# Altium schematic sheet CON_FMC_400PIN.SchDoc: FMC Connector
size A3; DocumentNumber: 12; SheetNumber: 12; SheetTotal: 12
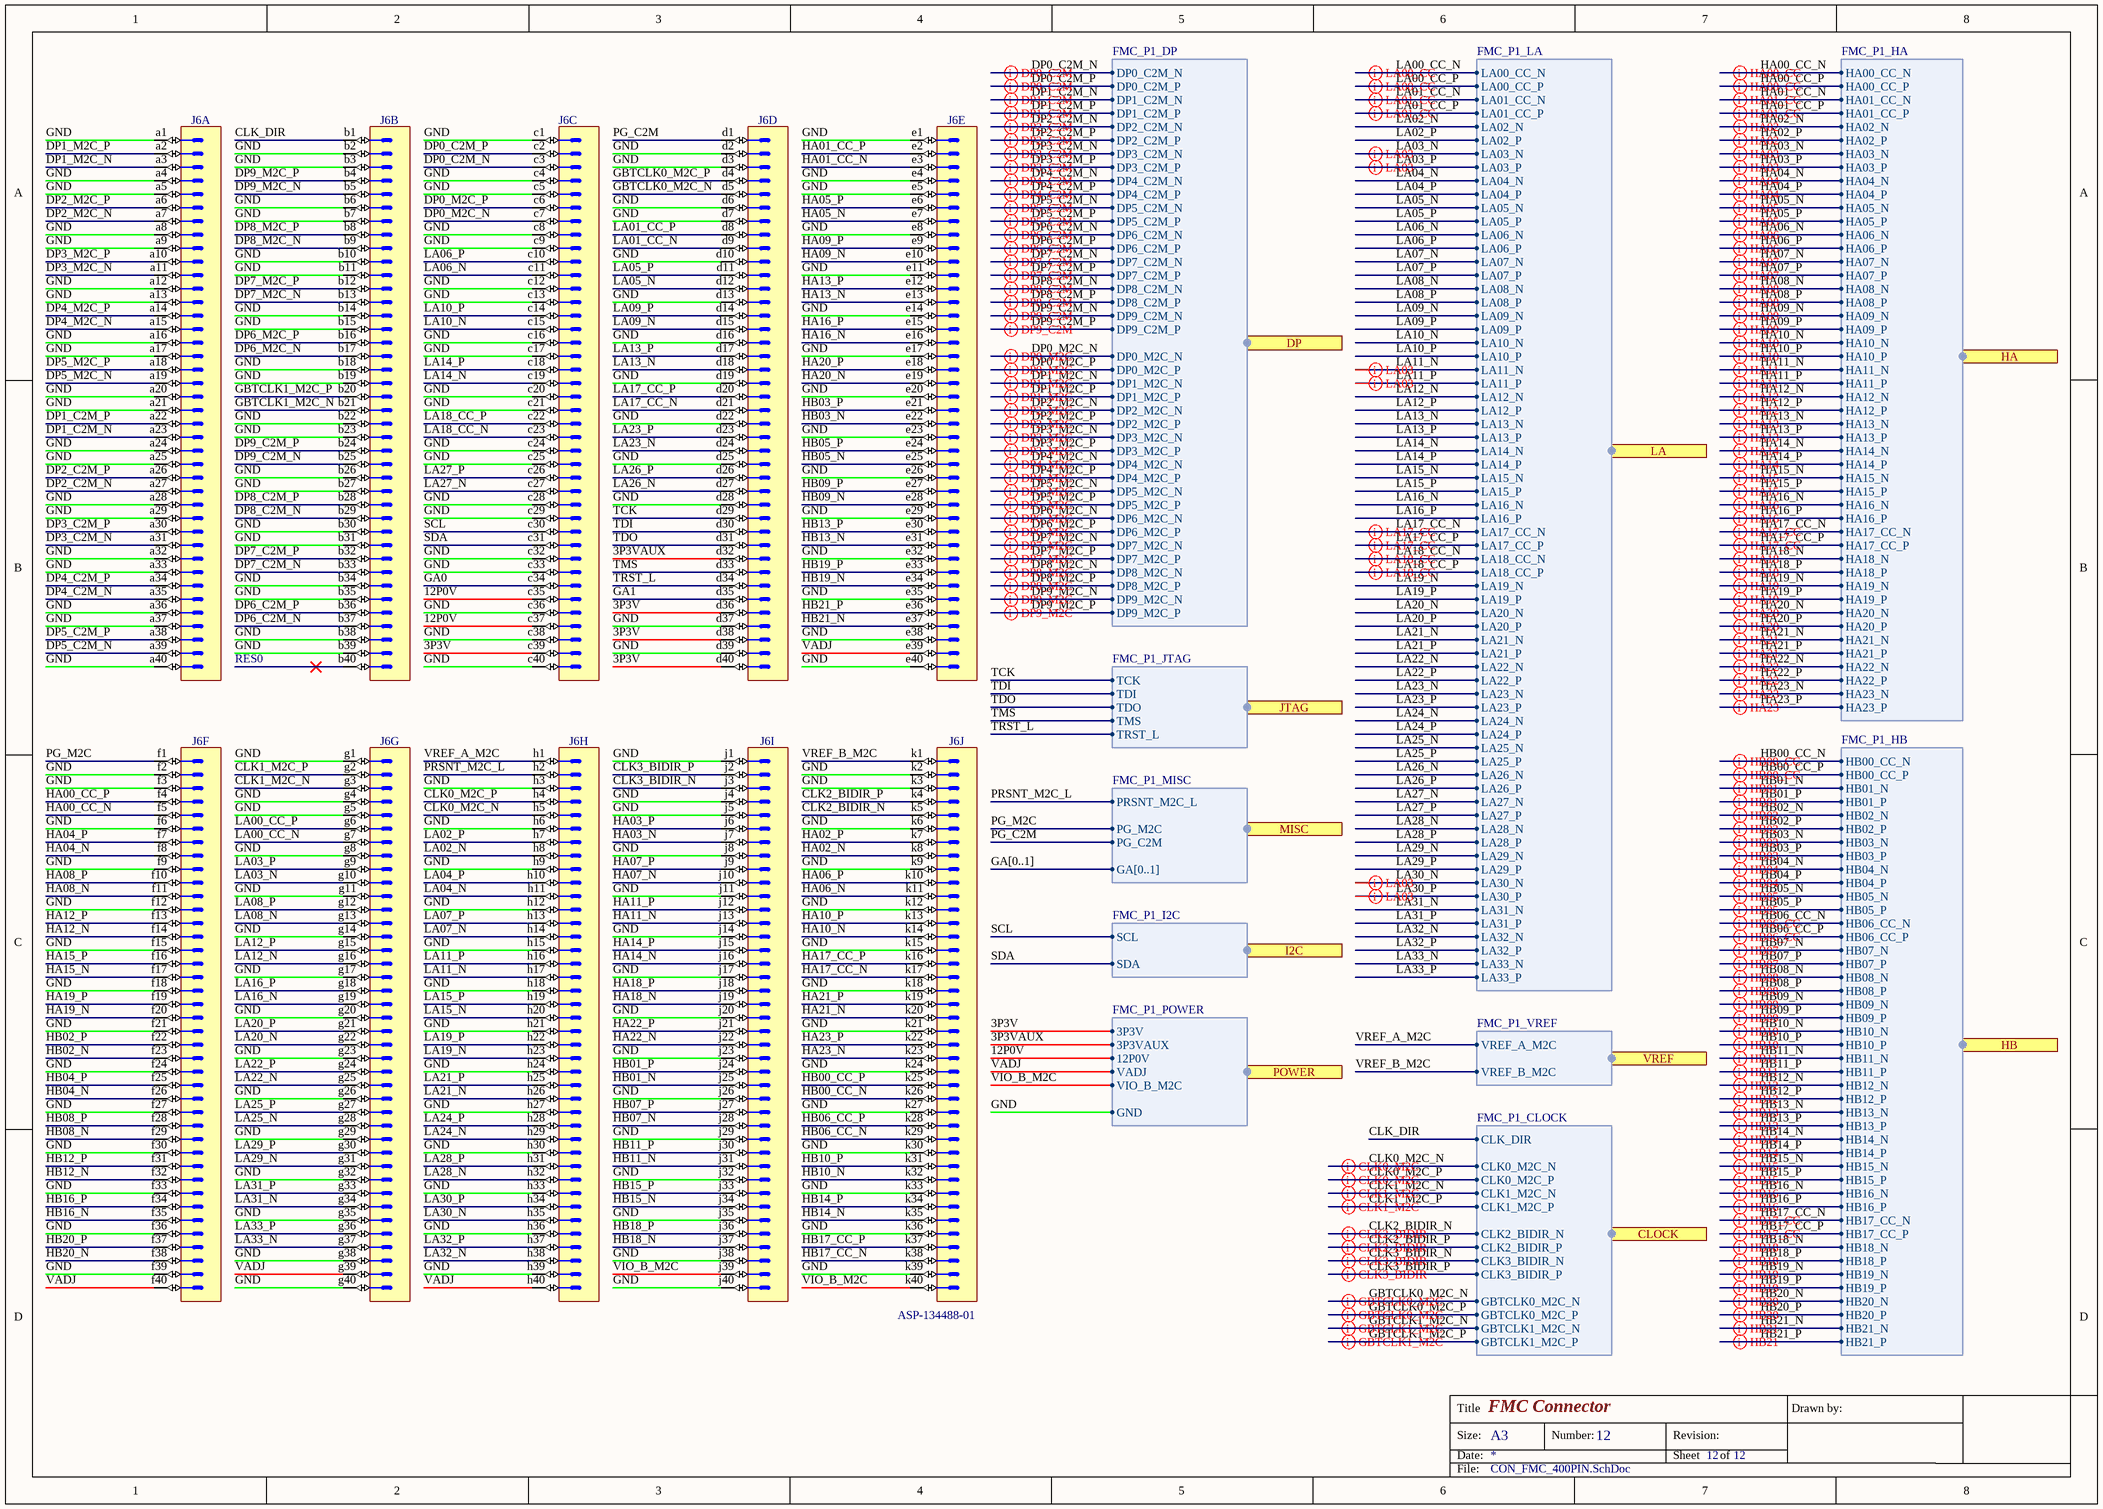
[diagram p0: CON_FMC_400PIN.SchDoc]

## Parts
J6  ASP-134488-01  [SAMTEC_ASP-134488-01]  (parts A,B,C,D,E,F,G,H,I,J of 10)

## Ports
CLOCK (harness FMC_P1_CLOCK), DP (harness FMC_P1_DP), HA (harness FMC_P1_HA), HB (harness FMC_P1_HB), I2C (harness FMC_P1_I2C), JTAG (harness FMC_P1_JTAG), LA (harness FMC_P1_LA), MISC (harness FMC_P1_MISC), POWER (harness FMC_P1_POWER), VREF (harness FMC_P1_VREF)

## Harnesses
FMC_P1_LA: LA05_N, LA05_P, LA06_N, LA06_P, LA09_N, LA09_P, LA10_N, LA10_P, LA13_N, LA13_P, LA14_N, LA14_P, LA23_N, LA23_P, LA26_N, LA26_P, LA27_N, LA27_P, LA02_N, LA02_P, LA03_N, LA03_P, LA04_N, LA04_P, LA07_N, LA07_P, LA08_N, LA08_P, LA11_N, LA11_P, LA12_N, LA12_P, LA15_N, LA15_P, LA16_N, LA16_P, LA19_N, LA19_P, LA20_N, LA20_P, LA21_N, LA21_P, LA22_N, LA22_P, LA24_N, LA24_P, LA25_N, LA25_P, LA28_N, LA28_P, LA29_N, LA29_P, LA30_N, LA30_P, LA31_N, LA31_P, LA32_N, LA32_P, LA33_N, LA33_P, LA00_CC_N, LA00_CC_P, LA01_CC_N, LA01_CC_P, LA17_CC_N, LA17_CC_P, LA18_CC_N, LA18_CC_P
FMC_P1_HA: HA04_N, HA04_P, HA05_N, HA05_P, HA08_N, HA08_P, HA09_N, HA09_P, HA12_N, HA12_P, HA13_N, HA13_P, HA15_N, HA15_P, HA16_N, HA16_P, HA19_N, HA19_P, HA20_N, HA20_P, HA02_N, HA02_P, HA03_N, HA03_P, HA06_N, HA06_P, HA07_N, HA07_P, HA10_N, HA10_P, HA11_N, HA11_P, HA14_N, HA14_P, HA18_N, HA18_P, HA21_N, HA21_P, HA22_N, HA22_P, HA23_N, HA23_P, HA17_CC_N, HA17_CC_P, HA00_CC_N, HA00_CC_P, HA01_CC_N, HA01_CC_P
FMC_P1_HB: HB02_N, HB02_P, HB03_N, HB03_P, HB04_N, HB04_P, HB05_N, HB05_P, HB08_N, HB08_P, HB09_N, HB09_P, HB12_N, HB12_P, HB13_N, HB13_P, HB16_N, HB16_P, HB19_N, HB19_P, HB20_N, HB20_P, HB21_N, HB21_P, HB01_N, HB01_P, HB07_N, HB07_P, HB10_N, HB10_P, HB11_N, HB11_P, HB14_N, HB14_P, HB15_N, HB15_P, HB18_N, HB18_P, HB17_CC_N, HB17_CC_P, HB06_CC_N, HB06_CC_P, HB00_CC_N, HB00_CC_P
FMC_P1_MISC: PRSNT_M2C_L, PG_M2C, PG_C2M, GA[0..1]
FMC_P1_POWER: 3P3V, 3P3VAUX, 12P0V, VADJ, VIO_B_M2C, GND
FMC_P1_JTAG: TCK, TDI, TDO, TMS, TRST_L
FMC_P1_I2C: SCL, SDA
FMC_P1_CLOCK: CLK2_BIDIR_N, CLK2_BIDIR_P, CLK3_BIDIR_N, CLK3_BIDIR_P, CLK0_M2C_N, CLK0_M2C_P, CLK1_M2C_N, CLK1_M2C_P, CLK_DIR, GBTCLK0_M2C_N, GBTCLK0_M2C_P, GBTCLK1_M2C_N, GBTCLK1_M2C_P
FMC_P1_VREF: VREF_A_M2C, VREF_B_M2C
FMC_P1_DP: DP1_C2M_N, DP1_C2M_P, DP1_M2C_N, DP1_M2C_P, DP2_C2M_N, DP2_C2M_P, DP2_M2C_N, DP2_M2C_P, DP3_C2M_N, DP3_C2M_P, DP3_M2C_N, DP3_M2C_P, DP4_C2M_N, DP4_C2M_P, DP4_M2C_N, DP4_M2C_P, DP5_C2M_N, DP5_C2M_P, DP5_M2C_N, DP5_M2C_P, DP6_C2M_N, DP6_C2M_P, DP6_M2C_N, DP6_M2C_P, DP7_C2M_N, DP7_C2M_P, DP7_M2C_N, DP7_M2C_P, DP8_C2M_N, DP8_C2M_P, DP8_M2C_N, DP8_M2C_P, DP9_C2M_N, DP9_C2M_P, DP9_M2C_N, DP9_M2C_P, DP0_C2M_N, DP0_C2M_P, DP0_M2C_N, DP0_M2C_P

## Nets
3P3V: J6.c39 J6.d36 J6.d38 J6.d40 ; port POWER.3P3V
3P3VAUX: J6.d32 ; port POWER.3P3VAUX
12P0V: J6.c35 J6.c37 ; port POWER.12P0V
CLK0_M2C_N: J6.h5 ; port CLOCK.CLK0_M2C_N
CLK0_M2C_P: J6.h4 ; port CLOCK.CLK0_M2C_P
CLK1_M2C_N: J6.g3 ; port CLOCK.CLK1_M2C_N
CLK1_M2C_P: J6.g2 ; port CLOCK.CLK1_M2C_P
CLK2_BIDIR_N: J6.k5 ; port CLOCK.CLK2_BIDIR_N
CLK2_BIDIR_P: J6.k4 ; port CLOCK.CLK2_BIDIR_P
CLK3_BIDIR_N: J6.j3 ; port CLOCK.CLK3_BIDIR_N
CLK3_BIDIR_P: J6.j2 ; port CLOCK.CLK3_BIDIR_P
CLK_DIR: J6.b1 ; port CLOCK.CLK_DIR
DP0_C2M_N: J6.c3 ; port DP.DP0_C2M_N
DP0_C2M_P: J6.c2 ; port DP.DP0_C2M_P
DP0_M2C_N: J6.c7 ; port DP.DP0_M2C_N
DP0_M2C_P: J6.c6 ; port DP.DP0_M2C_P
DP1_C2M_N: J6.a23 ; port DP.DP1_C2M_N
DP1_C2M_P: J6.a22 ; port DP.DP1_C2M_P
DP1_M2C_N: J6.a3 ; port DP.DP1_M2C_N
DP1_M2C_P: J6.a2 ; port DP.DP1_M2C_P
DP2_C2M_N: J6.a27 ; port DP.DP2_C2M_N
DP2_C2M_P: J6.a26 ; port DP.DP2_C2M_P
DP2_M2C_N: J6.a7 ; port DP.DP2_M2C_N
DP2_M2C_P: J6.a6 ; port DP.DP2_M2C_P
DP3_C2M_N: J6.a31 ; port DP.DP3_C2M_N
DP3_C2M_P: J6.a30 ; port DP.DP3_C2M_P
DP3_M2C_N: J6.a11 ; port DP.DP3_M2C_N
DP3_M2C_P: J6.a10 ; port DP.DP3_M2C_P
DP4_C2M_N: J6.a35 ; port DP.DP4_C2M_N
DP4_C2M_P: J6.a34 ; port DP.DP4_C2M_P
DP4_M2C_N: J6.a15 ; port DP.DP4_M2C_N
DP4_M2C_P: J6.a14 ; port DP.DP4_M2C_P
DP5_C2M_N: J6.a39 ; port DP.DP5_C2M_N
DP5_C2M_P: J6.a38 ; port DP.DP5_C2M_P
DP5_M2C_N: J6.a19 ; port DP.DP5_M2C_N
DP5_M2C_P: J6.a18 ; port DP.DP5_M2C_P
DP6_C2M_N: J6.b37 ; port DP.DP6_C2M_N
DP6_C2M_P: J6.b36 ; port DP.DP6_C2M_P
DP6_M2C_N: J6.b17 ; port DP.DP6_M2C_N
DP6_M2C_P: J6.b16 ; port DP.DP6_M2C_P
DP7_C2M_N: J6.b33 ; port DP.DP7_C2M_N
DP7_C2M_P: J6.b32 ; port DP.DP7_C2M_P
DP7_M2C_N: J6.b13 ; port DP.DP7_M2C_N
DP7_M2C_P: J6.b12 ; port DP.DP7_M2C_P
DP8_C2M_N: J6.b29 ; port DP.DP8_C2M_N
DP8_C2M_P: J6.b28 ; port DP.DP8_C2M_P
DP8_M2C_N: J6.b9 ; port DP.DP8_M2C_N
DP8_M2C_P: J6.b8 ; port DP.DP8_M2C_P
DP9_C2M_N: J6.b25 ; port DP.DP9_C2M_N
DP9_C2M_P: J6.b24 ; port DP.DP9_C2M_P
DP9_M2C_N: J6.b5 ; port DP.DP9_M2C_N
DP9_M2C_P: J6.b4 ; port DP.DP9_M2C_P
GA0: J6.c34
GA1: J6.d35
GBTCLK0_M2C_N: J6.d5 ; port CLOCK.GBTCLK0_M2C_N
GBTCLK0_M2C_P: J6.d4 ; port CLOCK.GBTCLK0_M2C_P
GBTCLK1_M2C_N: J6.b21 ; port CLOCK.GBTCLK1_M2C_N
GBTCLK1_M2C_P: J6.b20 ; port CLOCK.GBTCLK1_M2C_P
GND: J6.a1 J6.a4 J6.a5 J6.a8 J6.a9 J6.a12 J6.a13 J6.a16 J6.a17 J6.a20 J6.a21 J6.a24 J6.a25 J6.a28 J6.a29 J6.a32 J6.a33 J6.a36 J6.a37 J6.a40 J6.b2 J6.b3 J6.b6 J6.b7 J6.b10 J6.b11 J6.b14 J6.b15 J6.b18 J6.b19 J6.b22 J6.b23 J6.b26 J6.b27 J6.b30 J6.b31 J6.b34 J6.b35 J6.b38 J6.b39 J6.c1 J6.c4 J6.c5 J6.c8 J6.c9 J6.c12 J6.c13 J6.c16 J6.c17 J6.c20 J6.c21 J6.c24 J6.c25 J6.c28 J6.c29 J6.c32 J6.c33 J6.c36 J6.c38 J6.c40 J6.d2 J6.d3 J6.d6 J6.d7 J6.d10 J6.d13 J6.d16 J6.d19 J6.d22 J6.d25 J6.d28 J6.d37 J6.d39 J6.e1 J6.e4 J6.e5 J6.e8 J6.e11 J6.e14 J6.e17 J6.e20 J6.e23 J6.e26 J6.e29 J6.e32 J6.e35 J6.e38 J6.e40 J6.f2 J6.f3 J6.f6 J6.f9 J6.f12 J6.f15 J6.f18 J6.f21 J6.f24 J6.f27 J6.f30 J6.f33 J6.f36 J6.f39 J6.g1 J6.g4 J6.g5 J6.g8 J6.g11 J6.g14 J6.g17 J6.g20 J6.g23 J6.g26 J6.g29 J6.g32 J6.g35 J6.g38 J6.g40 J6.h3 J6.h6 J6.h9 J6.h12 J6.h15 J6.h18 J6.h21 J6.h24 J6.h27 J6.h30 J6.h33 J6.h36 J6.h39 J6.j1 J6.j4 J6.j5 J6.j8 J6.j11 J6.j14 J6.j17 J6.j20 J6.j23 J6.j26 J6.j29 J6.j32 J6.j35 J6.j38 J6.j40 J6.k2 J6.k3 J6.k6 J6.k9 J6.k12 J6.k15 J6.k18 J6.k21 J6.k24 J6.k27 J6.k30 J6.k33 J6.k36 J6.k39 ; port POWER.GND
HA00_CC_N: J6.f5 ; port HA.HA00_CC_N
HA00_CC_P: J6.f4 ; port HA.HA00_CC_P
HA01_CC_N: J6.e3 ; port HA.HA01_CC_N
HA01_CC_P: J6.e2 ; port HA.HA01_CC_P
HA02_N: J6.k8 ; port HA.HA02_N
HA02_P: J6.k7 ; port HA.HA02_P
HA03_N: J6.j7 ; port HA.HA03_N
HA03_P: J6.j6 ; port HA.HA03_P
HA04_N: J6.f8 ; port HA.HA04_N
HA04_P: J6.f7 ; port HA.HA04_P
HA05_N: J6.e7 ; port HA.HA05_N
HA05_P: J6.e6 ; port HA.HA05_P
HA06_N: J6.k11 ; port HA.HA06_N
HA06_P: J6.k10 ; port HA.HA06_P
HA07_N: J6.j10 ; port HA.HA07_N
HA07_P: J6.j9 ; port HA.HA07_P
HA08_N: J6.f11 ; port HA.HA08_N
HA08_P: J6.f10 ; port HA.HA08_P
HA09_N: J6.e10 ; port HA.HA09_N
HA09_P: J6.e9 ; port HA.HA09_P
HA10_N: J6.k14 ; port HA.HA10_N
HA10_P: J6.k13 ; port HA.HA10_P
HA11_N: J6.j13 ; port HA.HA11_N
HA11_P: J6.j12 ; port HA.HA11_P
HA12_N: J6.f14 ; port HA.HA12_N
HA12_P: J6.f13 ; port HA.HA12_P
HA13_N: J6.e13 ; port HA.HA13_N
HA13_P: J6.e12 ; port HA.HA13_P
HA14_N: J6.j16 ; port HA.HA14_N
HA14_P: J6.j15 ; port HA.HA14_P
HA15_N: J6.f17 ; port HA.HA15_N
HA15_P: J6.f16 ; port HA.HA15_P
HA16_N: J6.e16 ; port HA.HA16_N
HA16_P: J6.e15 ; port HA.HA16_P
HA17_CC_N: J6.k17 ; port HA.HA17_CC_N
HA17_CC_P: J6.k16 ; port HA.HA17_CC_P
HA18_N: J6.j19 ; port HA.HA18_N
HA18_P: J6.j18 ; port HA.HA18_P
HA19_N: J6.f20 ; port HA.HA19_N
HA19_P: J6.f19 ; port HA.HA19_P
HA20_N: J6.e19 ; port HA.HA20_N
HA20_P: J6.e18 ; port HA.HA20_P
HA21_N: J6.k20 ; port HA.HA21_N
HA21_P: J6.k19 ; port HA.HA21_P
HA22_N: J6.j22 ; port HA.HA22_N
HA22_P: J6.j21 ; port HA.HA22_P
HA23_N: J6.k23 ; port HA.HA23_N
HA23_P: J6.k22 ; port HA.HA23_P
HB00_CC_N: J6.k26 ; port HB.HB00_CC_N
HB00_CC_P: J6.k25 ; port HB.HB00_CC_P
HB01_N: J6.j25 ; port HB.HB01_N
HB01_P: J6.j24 ; port HB.HB01_P
HB02_N: J6.f23 ; port HB.HB02_N
HB02_P: J6.f22 ; port HB.HB02_P
HB03_N: J6.e22 ; port HB.HB03_N
HB03_P: J6.e21 ; port HB.HB03_P
HB04_N: J6.f26 ; port HB.HB04_N
HB04_P: J6.f25 ; port HB.HB04_P
HB05_N: J6.e25 ; port HB.HB05_N
HB05_P: J6.e24 ; port HB.HB05_P
HB06_CC_N: J6.k29 ; port HB.HB06_CC_N
HB06_CC_P: J6.k28 ; port HB.HB06_CC_P
HB07_N: J6.j28 ; port HB.HB07_N
HB07_P: J6.j27 ; port HB.HB07_P
HB08_N: J6.f29 ; port HB.HB08_N
HB08_P: J6.f28 ; port HB.HB08_P
HB09_N: J6.e28 ; port HB.HB09_N
HB09_P: J6.e27 ; port HB.HB09_P
HB10_N: J6.k32 ; port HB.HB10_N
HB10_P: J6.k31 ; port HB.HB10_P
HB11_N: J6.j31 ; port HB.HB11_N
HB11_P: J6.j30 ; port HB.HB11_P
HB12_N: J6.f32 ; port HB.HB12_N
HB12_P: J6.f31 ; port HB.HB12_P
HB13_N: J6.e31 ; port HB.HB13_N
HB13_P: J6.e30 ; port HB.HB13_P
HB14_N: J6.k35 ; port HB.HB14_N
HB14_P: J6.k34 ; port HB.HB14_P
HB15_N: J6.j34 ; port HB.HB15_N
HB15_P: J6.j33 ; port HB.HB15_P
HB16_N: J6.f35 ; port HB.HB16_N
HB16_P: J6.f34 ; port HB.HB16_P
HB17_CC_N: J6.k38 ; port HB.HB17_CC_N
HB17_CC_P: J6.k37 ; port HB.HB17_CC_P
HB18_N: J6.j37 ; port HB.HB18_N
HB18_P: J6.j36 ; port HB.HB18_P
HB19_N: J6.e34 ; port HB.HB19_N
HB19_P: J6.e33 ; port HB.HB19_P
HB20_N: J6.f38 ; port HB.HB20_N
HB20_P: J6.f37 ; port HB.HB20_P
HB21_N: J6.e37 ; port HB.HB21_N
HB21_P: J6.e36 ; port HB.HB21_P
LA00_CC_N: J6.g7 ; port LA.LA00_CC_N
LA00_CC_P: J6.g6 ; port LA.LA00_CC_P
LA01_CC_N: J6.d9 ; port LA.LA01_CC_N
LA01_CC_P: J6.d8 ; port LA.LA01_CC_P
LA02_N: J6.h8 ; port LA.LA02_N
LA02_P: J6.h7 ; port LA.LA02_P
LA03_N: J6.g10 ; port LA.LA03_N
LA03_P: J6.g9 ; port LA.LA03_P
LA04_N: J6.h11 ; port LA.LA04_N
LA04_P: J6.h10 ; port LA.LA04_P
LA05_N: J6.d12 ; port LA.LA05_N
LA05_P: J6.d11 ; port LA.LA05_P
LA06_N: J6.c11 ; port LA.LA06_N
LA06_P: J6.c10 ; port LA.LA06_P
LA07_N: J6.h14 ; port LA.LA07_N
LA07_P: J6.h13 ; port LA.LA07_P
LA08_N: J6.g13 ; port LA.LA08_N
LA08_P: J6.g12 ; port LA.LA08_P
LA09_N: J6.d15 ; port LA.LA09_N
LA09_P: J6.d14 ; port LA.LA09_P
LA10_N: J6.c15 ; port LA.LA10_N
LA10_P: J6.c14 ; port LA.LA10_P
LA11_N: J6.h17 ; port LA.LA11_N
LA11_P: J6.h16 ; port LA.LA11_P
LA12_N: J6.g16 ; port LA.LA12_N
LA12_P: J6.g15 ; port LA.LA12_P
LA13_N: J6.d18 ; port LA.LA13_N
LA13_P: J6.d17 ; port LA.LA13_P
LA14_N: J6.c19 ; port LA.LA14_N
LA14_P: J6.c18 ; port LA.LA14_P
LA15_N: J6.h20 ; port LA.LA15_N
LA15_P: J6.h19 ; port LA.LA15_P
LA16_N: J6.g19 ; port LA.LA16_N
LA16_P: J6.g18 ; port LA.LA16_P
LA17_CC_N: J6.d21 ; port LA.LA17_CC_N
LA17_CC_P: J6.d20 ; port LA.LA17_CC_P
LA18_CC_N: J6.c23 ; port LA.LA18_CC_N
LA18_CC_P: J6.c22 ; port LA.LA18_CC_P
LA19_N: J6.h23 ; port LA.LA19_N
LA19_P: J6.h22 ; port LA.LA19_P
LA20_N: J6.g22 ; port LA.LA20_N
LA20_P: J6.g21 ; port LA.LA20_P
LA21_N: J6.h26 ; port LA.LA21_N
LA21_P: J6.h25 ; port LA.LA21_P
LA22_N: J6.g25 ; port LA.LA22_N
LA22_P: J6.g24 ; port LA.LA22_P
LA23_N: J6.d24 ; port LA.LA23_N
LA23_P: J6.d23 ; port LA.LA23_P
LA24_N: J6.h29 ; port LA.LA24_N
LA24_P: J6.h28 ; port LA.LA24_P
LA25_N: J6.g28 ; port LA.LA25_N
LA25_P: J6.g27 ; port LA.LA25_P
LA26_N: J6.d27 ; port LA.LA26_N
LA26_P: J6.d26 ; port LA.LA26_P
LA27_N: J6.c27 ; port LA.LA27_N
LA27_P: J6.c26 ; port LA.LA27_P
LA28_N: J6.h32 ; port LA.LA28_N
LA28_P: J6.h31 ; port LA.LA28_P
LA29_N: J6.g31 ; port LA.LA29_N
LA29_P: J6.g30 ; port LA.LA29_P
LA30_N: J6.h35 ; port LA.LA30_N
LA30_P: J6.h34 ; port LA.LA30_P
LA31_N: J6.g34 ; port LA.LA31_N
LA31_P: J6.g33 ; port LA.LA31_P
LA32_N: J6.h38 ; port LA.LA32_N
LA32_P: J6.h37 ; port LA.LA32_P
LA33_N: J6.g37 ; port LA.LA33_N
LA33_P: J6.g36 ; port LA.LA33_P
PG_C2M: J6.d1 ; port MISC.PG_C2M
PG_M2C: J6.f1 ; port MISC.PG_M2C
PRSNT_M2C_L: J6.h2 ; port MISC.PRSNT_M2C_L
SCL: J6.c30 ; port I2C.SCL
SDA: J6.c31 ; port I2C.SDA
TCK: J6.d29 ; port JTAG.TCK
TDI: J6.d30 ; port JTAG.TDI
TDO: J6.d31 ; port JTAG.TDO
TMS: J6.d33 ; port JTAG.TMS
TRST_L: J6.d34 ; port JTAG.TRST_L
VADJ: J6.e39 J6.f40 J6.g39 J6.h40 ; port POWER.VADJ
VIO_B_M2C: J6.j39 J6.k40 ; port POWER.VIO_B_M2C
VREF_A_M2C: J6.h1 ; port VREF.VREF_A_M2C
VREF_B_M2C: J6.k1 ; port VREF.VREF_B_M2C

Not connected (* = marked no-connect by the designer): J6 b40*

## Buses and harness runs
bus GA[0..1]

## Layout directives
differential pair: CLK0_M2C_N, CLK0_M2C_P, CLK1_M2C_N, CLK1_M2C_P, CLK2_BIDIR_N, CLK2_BIDIR_P, CLK3_BIDIR_N, CLK3_BIDIR_P, DP0_C2M_N, DP0_C2M_P, DP0_M2C_N, DP0_M2C_P, DP1_C2M_N, DP1_C2M_P, DP1_M2C_N, DP1_M2C_P, DP2_C2M_N, DP2_C2M_P, DP2_M2C_N, DP2_M2C_P, DP3_C2M_N, DP3_C2M_P, DP3_M2C_N, DP3_M2C_P, DP4_C2M_N, DP4_C2M_P, DP4_M2C_N, DP4_M2C_P, DP5_C2M_N, DP5_C2M_P, DP5_M2C_N, DP5_M2C_P, DP6_C2M_N, DP6_C2M_P, DP6_M2C_N, DP6_M2C_P, DP7_C2M_N, DP7_C2M_P, DP7_M2C_N, DP7_M2C_P, DP8_C2M_N, DP8_C2M_P, DP8_M2C_N, DP8_M2C_P, DP9_C2M_N, DP9_C2M_P, DP9_M2C_N, DP9_M2C_P, GBTCLK0_M2C_N, GBTCLK0_M2C_P, GBTCLK1_M2C_N, GBTCLK1_M2C_P, HA00_CC_N, HA00_CC_P, HA01_CC_N, HA01_CC_P, HA02_N, HA02_P, HA03_N, HA03_P, HA04_N, HA04_P, HA05_N, HA05_P, HA06_N, HA06_P, HA07_N, HA07_P, HA08_N, HA08_P, HA09_N, HA09_P, HA10_N, HA10_P, HA11_N, HA11_P, HA12_N, HA12_P, HA13_N, HA13_P, HA14_N, HA14_P, HA15_N, HA15_P, HA16_N, HA16_P, HA17_CC_N, HA17_CC_P, HA18_N, HA18_P, HA19_N, HA19_P, HA20_N, HA20_P, HA21_N, HA21_P, HA22_N, HA22_P, HA23_N, HA23_P, HB00_CC_N, HB00_CC_P, HB01_N, HB01_P, HB02_N, HB02_P, HB03_N, HB03_P, HB04_N, HB04_P, HB05_N, HB05_P, HB06_CC_N, HB06_CC_P, HB07_N, HB07_P, HB08_N, HB08_P, HB09_N, HB09_P, HB10_N, HB10_P, HB11_N, HB11_P, HB12_N, HB12_P, HB13_N, HB13_P, HB14_N, HB14_P, HB15_N, HB15_P, HB16_N, HB16_P, HB17_CC_N, HB17_CC_P, HB18_N, HB18_P, HB19_N, HB19_P, HB20_N, HB20_P, HB21_N, HB21_P, LA00_CC_N, LA00_CC_P, LA01_CC_N, LA01_CC_P, LA03_N, LA03_P, LA11_N, LA11_P, LA17_CC_N, LA17_CC_P, LA18_CC_N, LA18_CC_P, LA30_N, LA30_P

## Notes on the sheet
- RES0
- Title
- Size:
- Date:
- A3
- Number:
- Revision:
- Sheet
- of
- Drawn by:
- File:

## Library data of the parts
J6 = SAMTEC_ASP-134488-01: Connector VITA 57, 400 Male contacts in 10 row abcdefghj; Part Description: 400 contacts (10 rows abcdefghj) Surface Mount Male Connector, VITA 57 (MC-HPC-10); Manufacturer: SAMTEC; PressFit: No; Part Number: SAMTEC_ASP-134488-01; Component Kind: Standard; Component Type: Standard; Pin Count: 400; Family: VITA 57; Mounted: Yes; Socket: No; Sense: No; SMD: Yes; Status: None; Manufacturer Part Number: ASP-134488-01; ComponentHeight: 6.1mm; HelpURL: \\cern.ch\dfs\Applications\Altium\Datasheets\SAMTEC_ASP-134488-01.pdf; Author: CERN DEM JLC; CreateDate: 30.04.2009; LatestRevisionDate: 17.08.2009